# Altium schematic sheet current_sense.SchDoc
size B; Address1: MILWAUKEE TOOL; Address2: 13135 W. Lisbon Rd.; Address3: Brookfield, WI 53005; SheetNumber: 1; SheetTotal: 1
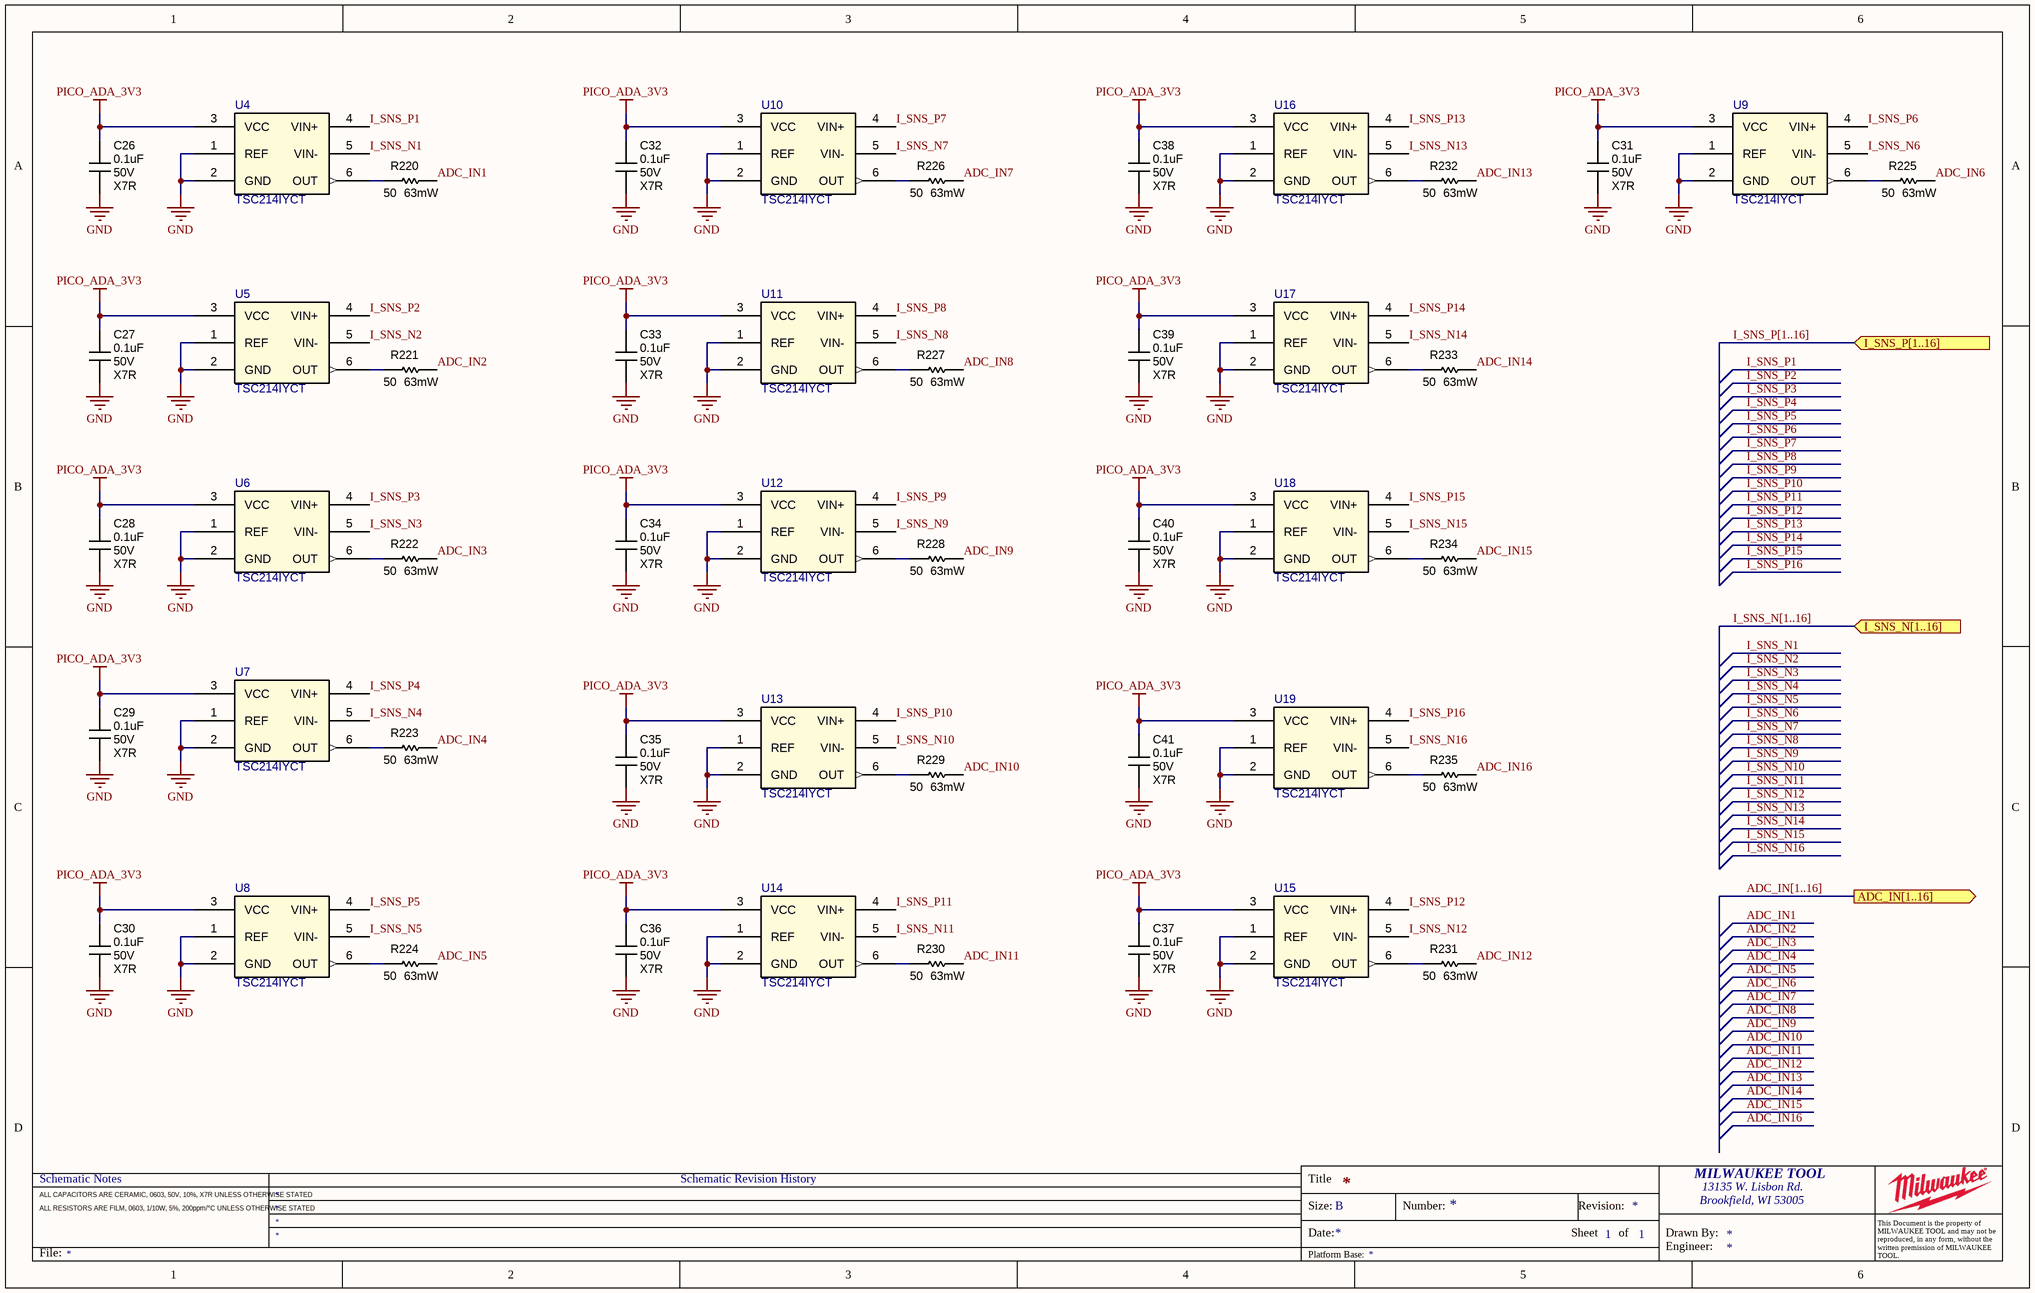
[diagram p0: current_sense.SchDoc]

## Parts
C26  0.1uF  Voltage Rating: 50V  Temp Coeff: X7R  [CAPC1005X06N]
C27  0.1uF  Voltage Rating: 50V  Temp Coeff: X7R  [CAPC1005X06N]
C28  0.1uF  Voltage Rating: 50V  Temp Coeff: X7R  [CAPC1005X06N]
C29  0.1uF  Voltage Rating: 50V  Temp Coeff: X7R  [CAPC1005X06N]
C30  0.1uF  Voltage Rating: 50V  Temp Coeff: X7R  [CAPC1005X06N]
C31  0.1uF  Voltage Rating: 50V  Temp Coeff: X7R  [CAPC1005X06N]
C32  0.1uF  Voltage Rating: 50V  Temp Coeff: X7R  [CAPC1005X06N]
C33  0.1uF  Voltage Rating: 50V  Temp Coeff: X7R  [CAPC1005X06N]
C34  0.1uF  Voltage Rating: 50V  Temp Coeff: X7R  [CAPC1005X06N]
C35  0.1uF  Voltage Rating: 50V  Temp Coeff: X7R  [CAPC1005X06N]
C36  0.1uF  Voltage Rating: 50V  Temp Coeff: X7R  [CAPC1005X06N]
C37  0.1uF  Voltage Rating: 50V  Temp Coeff: X7R  [CAPC1005X06N]
C38  0.1uF  Voltage Rating: 50V  Temp Coeff: X7R  [CAPC1005X06N]
C39  0.1uF  Voltage Rating: 50V  Temp Coeff: X7R  [CAPC1005X06N]
C40  0.1uF  Voltage Rating: 50V  Temp Coeff: X7R  [CAPC1005X06N]
C41  0.1uF  Voltage Rating: 50V  Temp Coeff: X7R  [CAPC1005X06N]
R220  50  Wattage: 63mW  [RESC1005X04N]
R221  50  Wattage: 63mW  [RESC1005X04N]
R222  50  Wattage: 63mW  [RESC1005X04N]
R223  50  Wattage: 63mW  [RESC1005X04N]
R224  50  Wattage: 63mW  [RESC1005X04N]
R225  50  Wattage: 63mW  [RESC1005X04N]
R226  50  Wattage: 63mW  [RESC1005X04N]
R227  50  Wattage: 63mW  [RESC1005X04N]
R228  50  Wattage: 63mW  [RESC1005X04N]
R229  50  Wattage: 63mW  [RESC1005X04N]
R230  50  Wattage: 63mW  [RESC1005X04N]
R231  50  Wattage: 63mW  [RESC1005X04N]
R232  50  Wattage: 63mW  [RESC1005X04N]
R233  50  Wattage: 63mW  [RESC1005X04N]
R234  50  Wattage: 63mW  [RESC1005X04N]
R235  50  Wattage: 63mW  [RESC1005X04N]
U4  TSC214IYCT  [SOT65P210X110-6N]
U5  TSC214IYCT  [SOT65P210X110-6N]
U6  TSC214IYCT  [SOT65P210X110-6N]
U7  TSC214IYCT  [SOT65P210X110-6N]
U8  TSC214IYCT  [SOT65P210X110-6N]
U9  TSC214IYCT  [SOT65P210X110-6N]
U10  TSC214IYCT  [SOT65P210X110-6N]
U11  TSC214IYCT  [SOT65P210X110-6N]
U12  TSC214IYCT  [SOT65P210X110-6N]
U13  TSC214IYCT  [SOT65P210X110-6N]
U14  TSC214IYCT  [SOT65P210X110-6N]
U15  TSC214IYCT  [SOT65P210X110-6N]
U16  TSC214IYCT  [SOT65P210X110-6N]
U17  TSC214IYCT  [SOT65P210X110-6N]
U18  TSC214IYCT  [SOT65P210X110-6N]
U19  TSC214IYCT  [SOT65P210X110-6N]

## Ports
ADC_IN[1..16] (out), I_SNS_N[1..16] (in), I_SNS_P[1..16] (in)

## Nets
GND: C26.2 C27.2 C28.2 C29.2 C30.2 C31.2 C32.2 C33.2 C34.2 C35.2 C36.2 C37.2 C38.2 C39.2 C40.2 C41.2 U4.1(REF) U4.2(GND) U5.1(REF) U5.2(GND) U6.1(REF) U6.2(GND) U7.1(REF) U7.2(GND) U8.1(REF) U8.2(GND) U9.1(REF) U9.2(GND) U10.1(REF) U10.2(GND) U11.1(REF) U11.2(GND) U12.1(REF) U12.2(GND) U13.1(REF) U13.2(GND) U14.1(REF) U14.2(GND) U15.1(REF) U15.2(GND) U16.1(REF) U16.2(GND) U17.1(REF) U17.2(GND) U18.1(REF) U18.2(GND) U19.1(REF) U19.2(GND)
PICO_ADA_3V3: C26.1 C27.1 C28.1 C29.1 C30.1 C31.1 C32.1 C33.1 C34.1 C35.1 C36.1 C37.1 C38.1 C39.1 C40.1 C41.1 U4.3(VCC) U5.3(VCC) U6.3(VCC) U7.3(VCC) U8.3(VCC) U9.3(VCC) U10.3(VCC) U11.3(VCC) U12.3(VCC) U13.3(VCC) U14.3(VCC) U15.3(VCC) U16.3(VCC) U17.3(VCC) U18.3(VCC) U19.3(VCC)
ADC_IN1: R220.2
ADC_IN2: R221.2
ADC_IN3: R222.2
ADC_IN4: R223.2
ADC_IN5: R224.2
ADC_IN6: R225.2
ADC_IN7: R226.2
ADC_IN8: R227.2
ADC_IN9: R228.2
ADC_IN10: R229.2
ADC_IN11: R230.2
ADC_IN12: R231.2
ADC_IN13: R232.2
ADC_IN14: R233.2
ADC_IN15: R234.2
ADC_IN16: R235.2
I_SNS_N1: U4.5(VIN-)
I_SNS_N2: U5.5(VIN-)
I_SNS_N3: U6.5(VIN-)
I_SNS_N4: U7.5(VIN-)
I_SNS_N5: U8.5(VIN-)
I_SNS_N6: U9.5(VIN-)
I_SNS_N7: U10.5(VIN-)
I_SNS_N8: U11.5(VIN-)
I_SNS_N9: U12.5(VIN-)
I_SNS_N10: U13.5(VIN-)
I_SNS_N11: U14.5(VIN-)
I_SNS_N12: U15.5(VIN-)
I_SNS_N13: U16.5(VIN-)
I_SNS_N14: U17.5(VIN-)
I_SNS_N15: U18.5(VIN-)
I_SNS_N16: U19.5(VIN-)
I_SNS_P1: U4.4(VIN+)
I_SNS_P2: U5.4(VIN+)
I_SNS_P3: U6.4(VIN+)
I_SNS_P4: U7.4(VIN+)
I_SNS_P5: U8.4(VIN+)
I_SNS_P6: U9.4(VIN+)
I_SNS_P7: U10.4(VIN+)
I_SNS_P8: U11.4(VIN+)
I_SNS_P9: U12.4(VIN+)
I_SNS_P10: U13.4(VIN+)
I_SNS_P11: U14.4(VIN+)
I_SNS_P12: U15.4(VIN+)
I_SNS_P13: U16.4(VIN+)
I_SNS_P14: U17.4(VIN+)
I_SNS_P15: U18.4(VIN+)
I_SNS_P16: U19.4(VIN+)
NetR220_1: R220.1 U4.6(OUT)
NetR221_1: R221.1 U5.6(OUT)
NetR222_1: R222.1 U6.6(OUT)
NetR223_1: R223.1 U7.6(OUT)
NetR224_1: R224.1 U8.6(OUT)
NetR225_1: R225.1 U9.6(OUT)
NetR226_1: R226.1 U10.6(OUT)
NetR227_1: R227.1 U11.6(OUT)
NetR228_1: R228.1 U12.6(OUT)
NetR229_1: R229.1 U13.6(OUT)
NetR230_1: R230.1 U14.6(OUT)
NetR231_1: R231.1 U15.6(OUT)
NetR232_1: R232.1 U16.6(OUT)
NetR233_1: R233.1 U17.6(OUT)
NetR234_1: R234.1 U18.6(OUT)
NetR235_1: R235.1 U19.6(OUT)

## Buses and harness runs
bus ADC_IN[1..16] = port ADC_IN[1..16]
bus I_SNS_N[1..16] = port I_SNS_N[1..16]
bus I_SNS_P[1..16] = port I_SNS_P[1..16]

## Notes on the sheet
- Schematic Notes
- Schematic Revision History
- Title
- ALL CAPACITORS ARE CERAMIC, 0603, 50V, 10%, X7R UNLESS OTHERWISE STATED
- ALL RESISTORS ARE FILM, 0603, 1/10W, 5%, 200ppm/°C UNLESS OTHERWISE STATED
- Size:
- Date:
- B
- Number:
- Sheet
- Revision:
- of
- Drawn By:
- Brookfield, WI 53005
- File:
- Platform Base:
- Engineer:
- This Document is the property of MILWAUKEE TOOL and may not be reproduced, in any form, without the written premission of MILWAUKEE TOOL.

## Library data of the parts
C26-C41 = CMP-004-0076: CAP CER SMD 0.1UF 50V X7R 0402; MFR3#: KGM05CR71H104KH; MFR#: GRM155R71H104KE14D; MFR: Murata Electronics; MFR4#: CL05B104KB54PNC; MFR2#: C1005X7R1H104K050BB; Tolerance: 10%; Populate: Yes; Temp Range: -55 / +125 C; Capacitor Type: Ceramic; Case Code (Imperial): 0402; Value: 0.1uF; MFR4: Samsung Electro-Mechanics; Design Item ID: CN/0.1uF/50V/X7R/10%/0402; Case Code (Metric): 1005; ComponentLink1URL: https://search.murata.co.jp/Ceramy/image/img/A01X/G101/ENG/GRM155R71H104KE14-01.pdf; MFR3: KYOCERA AVX; MFR2: TDK Corporation; ComponentLink1Description: Datasheet; RoHS Compliant: Yes; Part Status: Production
R220-R235 = CMP-025-0174: RES SMD 50R OHM 1% 1/16W 0402; MFR#: RN73R1ETTP50R0F50; MFR: KOA Speer Electronics; Value: 50 Ohm; Temp Range: -55 / +155 C; Temperature Coefficient: 50 ppm/°C; Populate: Yes; Tolerance: 1%; ComponentLink1Description: Datasheet; ComponentLink1URL: https://www.koaspeer.com/pdfs/RN73R.pdf; Resistor Type: Thick Film; Case Code (Imperial): 0402; Case Code (Metric): 1005; Design Item ID: R/50.0/0.063W/1%/0402; RoHS Compliant: Yes; Part Status: Production
U4-U19 = CMP-017-0113: IC CURR SENSE 1 CIRCUIT SC70-6; MFR: STMicroelectronics; Populate: Yes; REACFH SVCH: Unaffected; Temp Range, Ambient: -40 / +85 C; Voltage Range: 2.7V - 26V DC; Temp Range, Junction: -40 / +125C; Value: TSC214IYCT; MFR#: TSC214IYCT; Case Package: sot23-6; Design Item ID: IC/I_SNS/TSC214/SOT23-6; Part Status: Production; RoHS Comliant: Yes; Type: CURRENT SENSOR; ComponentLink1Description: Datasheet; ComponentLink1URL: https://www.st.com/resource/en/datasheet/tsc210.pdf